# EAGLE schematic untitled (EAGLE 6.5.0)
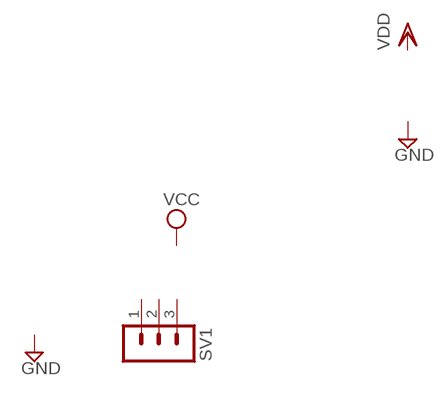
[diagram p0: schematic, sheet 1]

## Parts
SV1  MA03-1  [MA03-1]
Unconnected: SV1.1 SV1.2 SV1.3

## Library data of the parts
SV1 = con-lstb:MA03-1: PIN HEADER; OC_FARNELL: unknown; OC_NEWARK: unknown